# Altium schematic sheet PCB.SchDoc
size A4
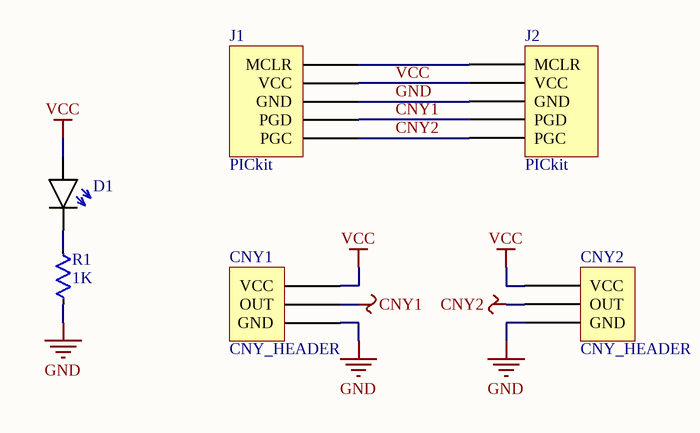
[diagram p0: PCB.SchDoc]

## Parts
CNY1  CNY_HEADER  [CNY_HEADER]
CNY2  CNY_HEADER  [CNY_HEADER]
D1  LED  [LED-3MM-RED]  (value not drawn)
J1  PICkit  [Header 1x5]
J2  PICkit  [Header 1x5]
R1  value 1K  [RES-Axial-400mil]  (hidden comment: RES)

## Nets
CNY1: CNY1.3(OUT) J1.4(PGD) J2.4(PGD)
CNY2: CNY2.3(OUT) J1.5(PGC) J2.5(PGC)
GND: CNY1.1(GND) CNY2.1(GND) J1.3(GND) J2.3(GND) R1.1
VCC: CNY1.2(VCC) CNY2.2(VCC) D1.A J1.2(VCC) J2.2(VCC)
NetD1_K: D1.K R1.2
NetJ1_1: J1.1(MCLR) J2.1(MCLR)